# Altium schematic sheet mb1045.SchDoc
size A3; Revision: B.2(PCB.SCH)
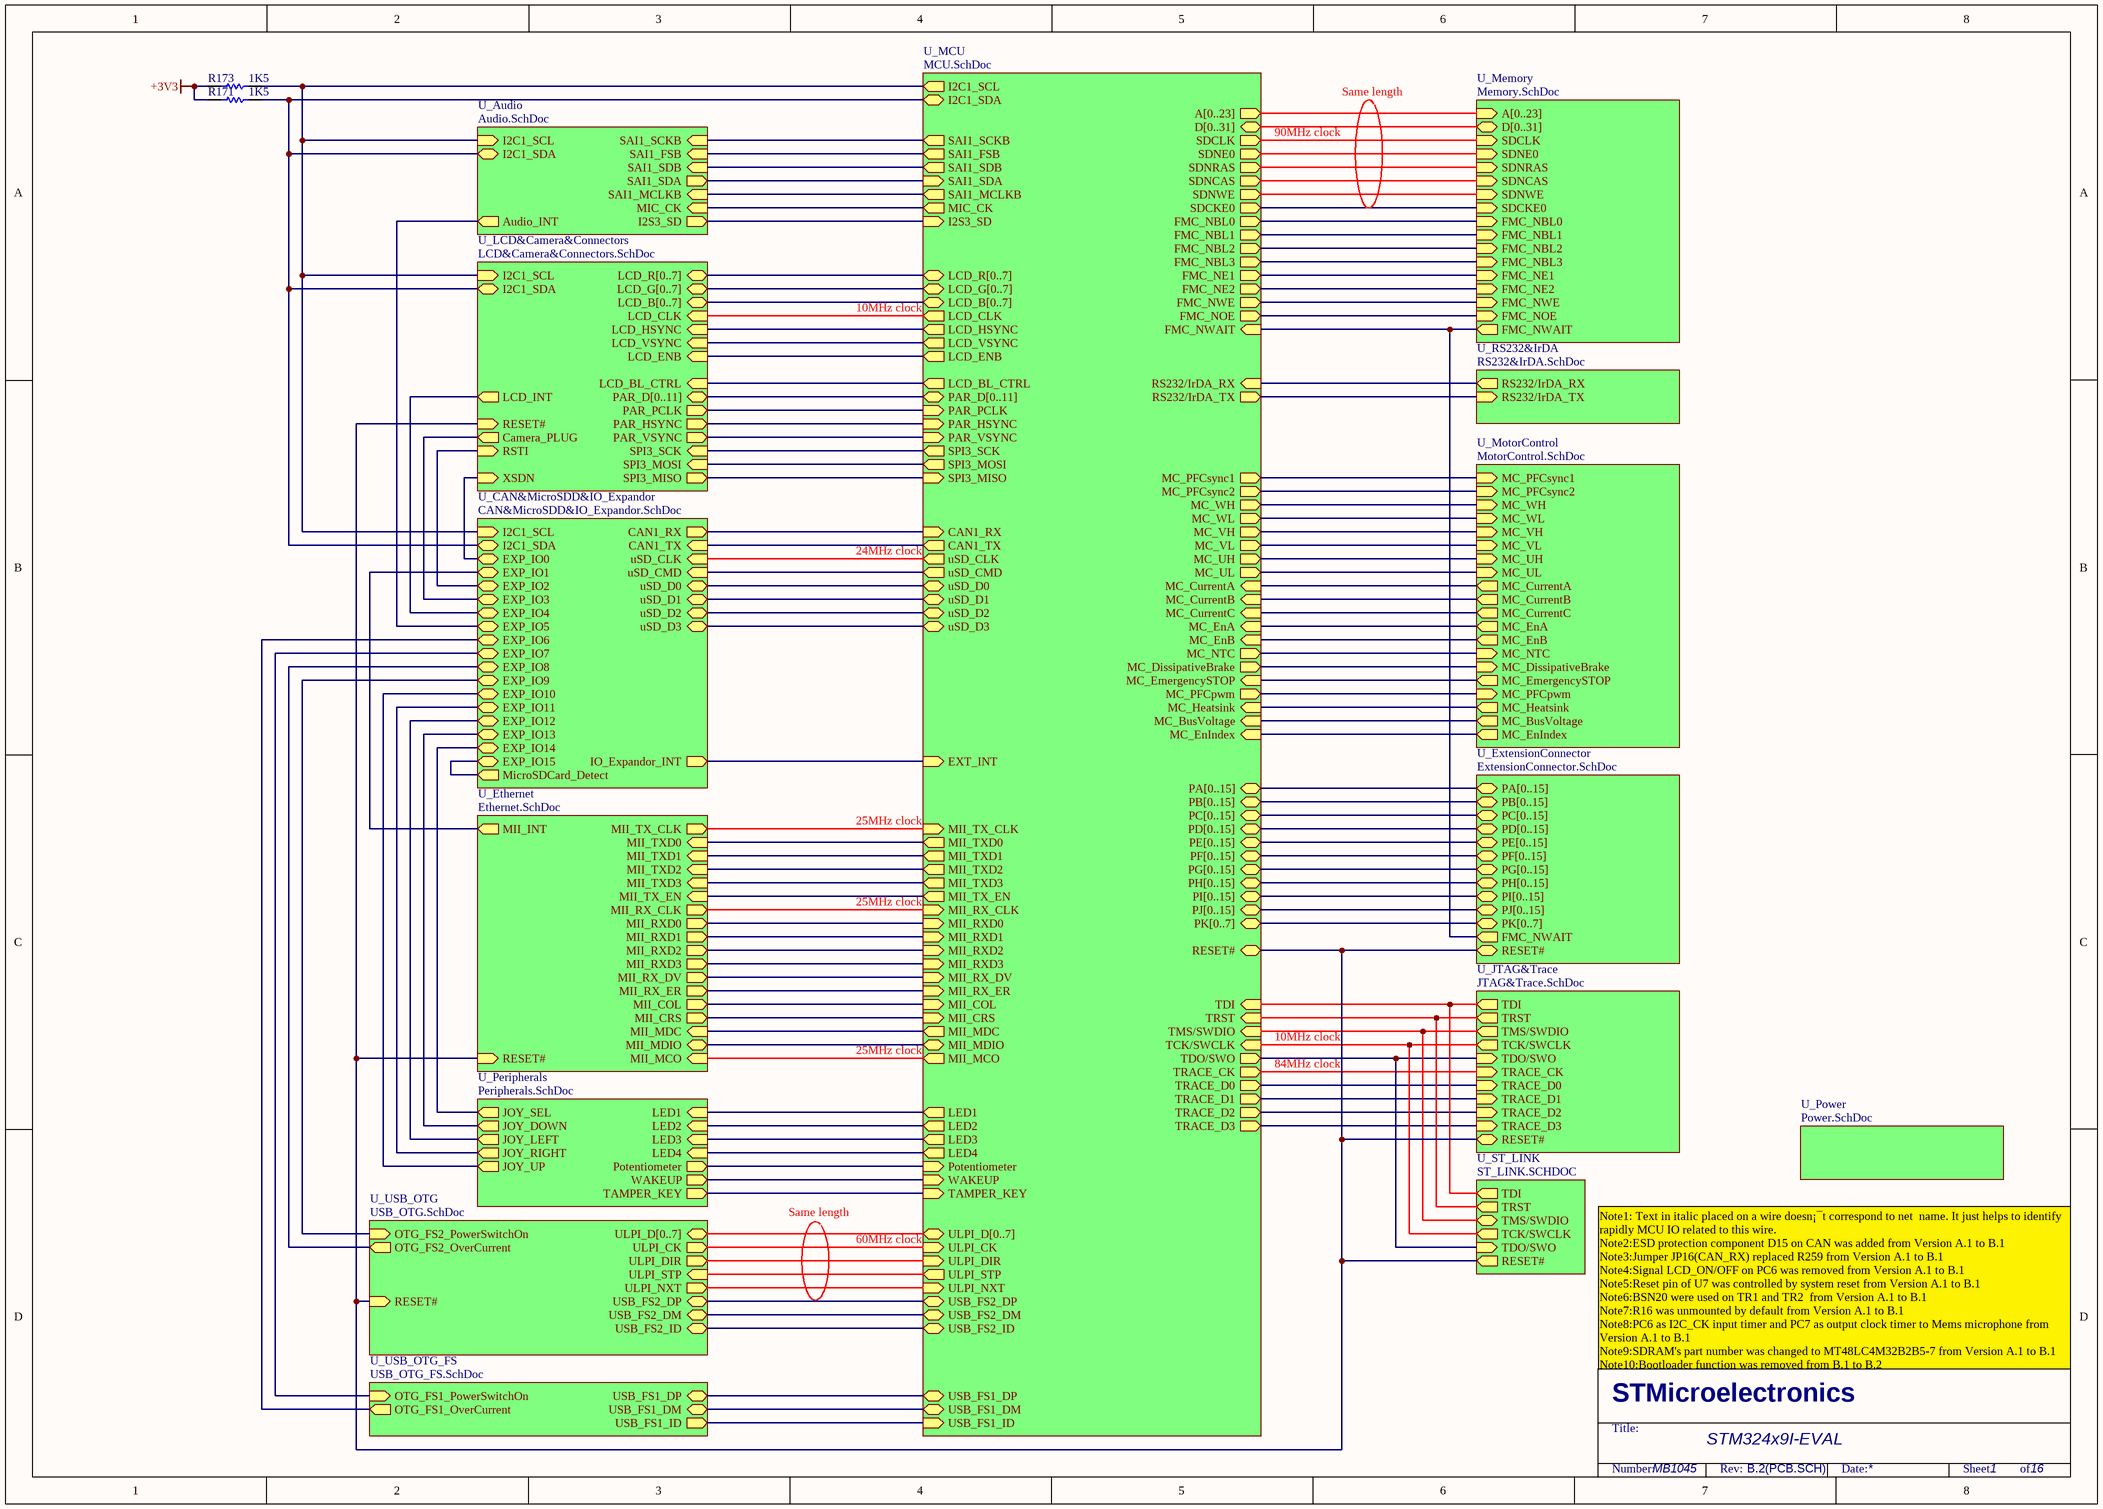
[diagram p0: mb1045.SchDoc]

## Parts
R171  1K5  [0603R]
R173  1K5  [0603R]

## Sub-sheets
U_Audio = Audio.SchDoc: SAI1_SCKB (in), SAI1_FSB (in), SAI1_SDB (in), SAI1_SDA (out), Audio_INT (out), I2C1_SDA (bidir), I2C1_SCL (in), SAI1_MCLKB (in), MIC_CK (in), I2S3_SD (out)
U_CAN&MicroSDD&IO_Expandor = CAN&MicroSDD&IO_Expandor.SchDoc: CAN1_TX (in), CAN1_RX (out), uSD_CLK (in), uSD_CMD (in), uSD_D0 (bidir), uSD_D1 (bidir), uSD_D2 (bidir), uSD_D3 (bidir), MicroSDCard_Detect (out), I2C1_SCL (in), I2C1_SDA (bidir), IO_Expandor_INT (out), EXP_IO2 (bidir), EXP_IO3 (bidir), EXP_IO4 (bidir), EXP_IO5 (bidir), EXP_IO6 (bidir), EXP_IO7 (bidir), EXP_IO8 (bidir), EXP_IO1 (bidir), EXP_IO9 (bidir), EXP_IO10 (bidir), EXP_IO11 (bidir), EXP_IO12 (bidir), EXP_IO13 (bidir), EXP_IO14 (bidir), EXP_IO15 (bidir), EXP_IO0 (bidir)
U_Ethernet = Ethernet.SchDoc: MII_TXD0 (in), MII_TX_EN (in), MII_TX_CLK (out), MII_RXD0 (out), MII_RX_ER (out), MII_RX_DV (out), MII_RX_CLK (out), MII_COL (out), MII_CRS (out), MII_MDC (in), MII_MDIO (bidir), RESET# (in), MII_TXD1 (in), MII_TXD2 (in), MII_TXD3 (in), MII_RXD1 (out), MII_RXD2 (out), MII_RXD3 (out), MII_INT (out), MII_MCO (in)
U_ExtensionConnector = ExtensionConnector.SchDoc: PA[0..15] (bidir), PB[0..15] (bidir), PC[0..15] (bidir), PD[0..15] (bidir), PE[0..15] (bidir), PF[0..15] (bidir), PG[0..15] (bidir), PH[0..15] (bidir), PI[0..15] (bidir), PJ[0..15] (bidir), PK[0..7] (bidir), RESET# (bidir), FMC_NWAIT (out)
U_JTAG&Trace = JTAG&Trace.SchDoc: TDI (out), RESET# (bidir), TRACE_D3 (in), TRACE_D2 (in), TRACE_D1 (in), TRACE_D0 (in), TRACE_CK (in), TRST (out), TMS/SWDIO (out), TCK/SWCLK (out), TDO/SWO (in)
U_LCD&Camera&Connectors = LCD&Camera&Connectors.SchDoc: LCD_R[0..7] (bidir), LCD_HSYNC (in), LCD_VSYNC (in), LCD_CLK (in), LCD_ENB (in), LCD_BL_CTRL (in), I2C1_SDA (bidir), I2C1_SCL (in), LCD_B[0..7] (bidir), LCD_G[0..7] (bidir), RSTI (in), XSDN (in), PAR_HSYNC (out), PAR_PCLK (out), PAR_VSYNC (out), PAR_D[0..11] (bidir), SPI3_SCK (in), SPI3_MISO (out), SPI3_MOSI (in), LCD_INT (out), Camera_PLUG (out), RESET# (in)
U_MCU = MCU.SchDoc: PA[0..15] (bidir), PB[0..15] (bidir), PC[0..15] (bidir), PD[0..15] (bidir), PE[0..15] (bidir), PF[0..15] (bidir), PG[0..15] (bidir), PH[0..15] (bidir), PI[0..15] (bidir), WAKEUP (in), MC_EnA (in), MII_RX_CLK (in), MC_EnB (in), MII_MDIO (bidir), MC_EnIndex (in), ULPI_CK (in), MC_EmergencySTOP (in), MII_RX_DV (in), MC_UL (out), LCD_BL_CTRL (out), MC_PFCsync1 (out), RS232/IrDA_TX (out), RS232/IrDA_RX (in), USB_FS1_ID (in), CAN1_RX (in), USB_FS1_DM (bidir), MC_PFCpwm (out), CAN1_TX (out), USB_FS1_DP (bidir), MC_PFCsync2 (out), TMS/SWDIO (in), TCK/SWCLK (in), TDI (in), MC_VL (out), MC_WL (out), TDO/SWO (out), MIC_CK (out), TRST (in), I2C1_SCL (out), MII_TXD3 (out), MC_DissipativeBrake (out), I2C1_SDA (bidir), USB_FS2_ID (bidir), USB_FS2_DM (bidir), USB_FS2_DP (bidir), ULPI_STP (out), MII_MDC (out), MC_CurrentA (in), MII_TXD2 (out), MC_CurrentB (in), MII_TX_CLK (in), MC_CurrentC (in), MII_RXD0 (in), MC_BusVoltage (in), MII_RXD1 (in), MC_Heatsink (in), MC_UH (out), MC_VH (out), uSD_D0 (bidir), MC_WH (out), uSD_D1 (bidir), uSD_D2 (bidir), SPI3_SCK (out), uSD_D3 (bidir), SPI3_MISO (in), uSD_CLK (out), SPI3_MOSI (out), TAMPER_KEY (in), MII_CRS (in), LCD_ENB (out), uSD_CMD (out), FMC_NOE (out), FMC_NWE (out), FMC_NWAIT (in), I2S3_SD (in), FMC_NE1 (out), FMC_NBL3 (out), FMC_NBL2 (out), EXT_INT (in), MII_RX_ER (in), ULPI_DIR (in), LCD_HSYNC (out), LCD_VSYNC (out), LCD_CLK (out), FMC_NBL0 (out), FMC_NBL1 (out), TRACE_CK (out), TRACE_D0 (out), TRACE_D2 (out), TRACE_D1 (out), SAI1_SDA (in), TRACE_D3 (out), SAI1_SDB (out), SAI1_SCKB (out), SAI1_FSB (out), SAI1_MCLKB (out), Potentiometer (in), SDNRAS (out), LED1 (out), LED2 (out), SDCLK (out), FMC_NE2 (out), LED4 (out), LED3 (out), MII_TX_EN (out), MC_NTC (out), MII_TXD0 (out), MII_TXD1 (out), SDNCAS (out), SDCKE0 (out), SDNE0 (out), MII_COL (in), ULPI_NXT (in), SDNWE (out), MII_RXD2 (in), MII_RXD3 (in), LCD_R[0..7] (bidir), LCD_G[0..7] (bidir), LCD_B[0..7] (bidir), D[0..31] (bidir), A[0..23] (out), ULPI_D[0..7] (bidir), RESET# (bidir), PJ[0..15] (bidir), PK[0..7] (bidir), PAR_HSYNC (in), PAR_PCLK (in), PAR_VSYNC (in), PAR_D[0..11] (bidir), MII_MCO (out)
U_Memory = Memory.SchDoc: FMC_NE2 (in), FMC_NE1 (in), FMC_NWE (in), FMC_NOE (in), FMC_NWAIT (out), FMC_NBL0 (in), FMC_NBL1 (in), D[0..31] (bidir), A[0..23] (in), SDNCAS (in), SDNWE (in), SDNRAS (in), SDNE0 (in), SDCKE0 (in), SDCLK (in), FMC_NBL3 (in), FMC_NBL2 (in)
U_MotorControl = MotorControl.SchDoc: MC_EmergencySTOP (out), MC_CurrentA (out), MC_CurrentB (out), MC_CurrentC (out), MC_PFCsync1 (in), MC_PFCsync2 (in), MC_WL (in), MC_VH (in), MC_VL (in), MC_UH (in), MC_UL (in), MC_WH (in), MC_NTC (in), MC_DissipativeBrake (in), MC_PFCpwm (in), MC_EnA (out), MC_EnB (out), MC_Heatsink (out), MC_BusVoltage (out), MC_EnIndex (out)
U_Peripherals = Peripherals.SchDoc: LED4 (in), LED3 (in), LED1 (in), LED2 (in), JOY_SEL (out), JOY_DOWN (out), JOY_LEFT (out), JOY_RIGHT (out), JOY_UP (out), Potentiometer (out), WAKEUP (out), TAMPER_KEY (out)
U_Power = Power.SchDoc: no entries
U_RS232&IrDA = RS232&IrDA.SchDoc: RS232/IrDA_TX (in), RS232/IrDA_RX (out)
U_ST_LINK = ST_LINK.SCHDOC: TDI (out), TRST (out), TMS/SWDIO (bidir), TCK/SWCLK (out), TDO/SWO (in), RESET# (out)
U_USB_OTG = USB_OTG.SchDoc: ULPI_D[0..7] (bidir), ULPI_CK (out), ULPI_DIR (out), ULPI_NXT (out), ULPI_STP (in), RESET# (in), USB_FS2_DM (bidir), USB_FS2_DP (bidir), OTG_FS2_PowerSwitchOn (in), OTG_FS2_OverCurrent (out), USB_FS2_ID (bidir)
U_USB_OTG_FS = USB_OTG_FS.SchDoc: OTG_FS1_PowerSwitchOn (in), OTG_FS1_OverCurrent (out), USB_FS1_DM (bidir), USB_FS1_DP (bidir), USB_FS1_ID (out)

## Nets
+3V3: R171.1 R173.1
NetR171_2: R171.2 ; sheet U_Audio/I2C1_SDA, sheet U_MCU/I2C1_SDA, sheet U_CAN&MicroSDD&IO_Expandor/I2C1_SDA, sheet U_LCD&Camera&Connectors/I2C1_SDA
NetR173_2: R173.2 ; sheet U_Audio/I2C1_SCL, sheet U_MCU/I2C1_SCL, sheet U_CAN&MicroSDD&IO_Expandor/I2C1_SCL, sheet U_LCD&Camera&Connectors/I2C1_SCL
(unnamed): sheet U_Audio/SAI1_SCKB, sheet U_MCU/SAI1_SCKB
(unnamed): sheet U_Audio/SAI1_FSB, sheet U_MCU/SAI1_FSB
(unnamed): sheet U_Audio/SAI1_SDB, sheet U_MCU/SAI1_SDB
(unnamed): sheet U_Audio/SAI1_SDA, sheet U_MCU/SAI1_SDA
(unnamed): sheet U_Audio/Audio_INT, sheet U_CAN&MicroSDD&IO_Expandor/EXP_IO5
(unnamed): sheet U_Audio/SAI1_MCLKB, sheet U_MCU/SAI1_MCLKB
(unnamed): sheet U_Audio/MIC_CK, sheet U_MCU/MIC_CK
(unnamed): sheet U_Audio/I2S3_SD, sheet U_MCU/I2S3_SD
(unnamed): sheet U_JTAG&Trace/TDI, sheet U_MCU/TDI, sheet U_ST_LINK/TDI
(unnamed): sheet U_JTAG&Trace/RESET#, sheet U_MCU/RESET#, sheet U_ST_LINK/RESET#, sheet U_USB_OTG/RESET#, sheet U_ExtensionConnector/RESET#, sheet U_LCD&Camera&Connectors/RESET#, sheet U_Ethernet/RESET#
(unnamed): sheet U_JTAG&Trace/TRACE_D3, sheet U_MCU/TRACE_D3
(unnamed): sheet U_JTAG&Trace/TRACE_D2, sheet U_MCU/TRACE_D2
(unnamed): sheet U_JTAG&Trace/TRACE_D1, sheet U_MCU/TRACE_D1
(unnamed): sheet U_JTAG&Trace/TRACE_D0, sheet U_MCU/TRACE_D0
(unnamed): sheet U_JTAG&Trace/TRACE_CK, sheet U_MCU/TRACE_CK
(unnamed): sheet U_JTAG&Trace/TRST, sheet U_MCU/TRST, sheet U_ST_LINK/TRST
(unnamed): sheet U_JTAG&Trace/TMS/SWDIO, sheet U_MCU/TMS/SWDIO, sheet U_ST_LINK/TMS/SWDIO
(unnamed): sheet U_JTAG&Trace/TCK/SWCLK, sheet U_MCU/TCK/SWCLK, sheet U_ST_LINK/TCK/SWCLK
(unnamed): sheet U_JTAG&Trace/TDO/SWO, sheet U_MCU/TDO/SWO, sheet U_ST_LINK/TDO/SWO
(unnamed): sheet U_MCU/WAKEUP, sheet U_Peripherals/WAKEUP
(unnamed): sheet U_MCU/MC_EnA, sheet U_MotorControl/MC_EnA
(unnamed): sheet U_MCU/MII_RX_CLK, sheet U_Ethernet/MII_RX_CLK
(unnamed): sheet U_MCU/MC_EnB, sheet U_MotorControl/MC_EnB
(unnamed): sheet U_MCU/MII_MDIO, sheet U_Ethernet/MII_MDIO
(unnamed): sheet U_MCU/MC_EnIndex, sheet U_MotorControl/MC_EnIndex
(unnamed): sheet U_MCU/ULPI_CK, sheet U_USB_OTG/ULPI_CK
(unnamed): sheet U_MCU/MC_EmergencySTOP, sheet U_MotorControl/MC_EmergencySTOP
(unnamed): sheet U_MCU/MII_RX_DV, sheet U_Ethernet/MII_RX_DV
(unnamed): sheet U_MCU/MC_UL, sheet U_MotorControl/MC_UL
(unnamed): sheet U_MCU/LCD_BL_CTRL, sheet U_LCD&Camera&Connectors/LCD_BL_CTRL
(unnamed): sheet U_MCU/MC_PFCsync1, sheet U_MotorControl/MC_PFCsync1
(unnamed): sheet U_MCU/RS232/IrDA_TX, sheet U_RS232&IrDA/RS232/IrDA_TX
(unnamed): sheet U_MCU/RS232/IrDA_RX, sheet U_RS232&IrDA/RS232/IrDA_RX
(unnamed): sheet U_MCU/USB_FS1_ID, sheet U_USB_OTG_FS/USB_FS1_ID
(unnamed): sheet U_MCU/CAN1_RX, sheet U_CAN&MicroSDD&IO_Expandor/CAN1_RX
(unnamed): sheet U_MCU/USB_FS1_DM, sheet U_USB_OTG_FS/USB_FS1_DM
(unnamed): sheet U_MCU/MC_PFCpwm, sheet U_MotorControl/MC_PFCpwm
(unnamed): sheet U_MCU/CAN1_TX, sheet U_CAN&MicroSDD&IO_Expandor/CAN1_TX
(unnamed): sheet U_MCU/USB_FS1_DP, sheet U_USB_OTG_FS/USB_FS1_DP
(unnamed): sheet U_MCU/MC_PFCsync2, sheet U_MotorControl/MC_PFCsync2
(unnamed): sheet U_MCU/MC_VL, sheet U_MotorControl/MC_VL
(unnamed): sheet U_MCU/MC_WL, sheet U_MotorControl/MC_WL
(unnamed): sheet U_MCU/MII_TXD3, sheet U_Ethernet/MII_TXD3
(unnamed): sheet U_MCU/MC_DissipativeBrake, sheet U_MotorControl/MC_DissipativeBrake
(unnamed): sheet U_MCU/USB_FS2_ID, sheet U_USB_OTG/USB_FS2_ID
(unnamed): sheet U_MCU/USB_FS2_DM, sheet U_USB_OTG/USB_FS2_DM
(unnamed): sheet U_MCU/USB_FS2_DP, sheet U_USB_OTG/USB_FS2_DP
(unnamed): sheet U_MCU/ULPI_STP, sheet U_USB_OTG/ULPI_STP
(unnamed): sheet U_MCU/MII_MDC, sheet U_Ethernet/MII_MDC
(unnamed): sheet U_MCU/MC_CurrentA, sheet U_MotorControl/MC_CurrentA
(unnamed): sheet U_MCU/MII_TXD2, sheet U_Ethernet/MII_TXD2
(unnamed): sheet U_MCU/MC_CurrentB, sheet U_MotorControl/MC_CurrentB
(unnamed): sheet U_MCU/MII_TX_CLK, sheet U_Ethernet/MII_TX_CLK
(unnamed): sheet U_MCU/MC_CurrentC, sheet U_MotorControl/MC_CurrentC
(unnamed): sheet U_MCU/MII_RXD0, sheet U_Ethernet/MII_RXD0
(unnamed): sheet U_MCU/MC_BusVoltage, sheet U_MotorControl/MC_BusVoltage
(unnamed): sheet U_MCU/MII_RXD1, sheet U_Ethernet/MII_RXD1
(unnamed): sheet U_MCU/MC_Heatsink, sheet U_MotorControl/MC_Heatsink
(unnamed): sheet U_MCU/MC_UH, sheet U_MotorControl/MC_UH
(unnamed): sheet U_MCU/MC_VH, sheet U_MotorControl/MC_VH
(unnamed): sheet U_MCU/uSD_D0, sheet U_CAN&MicroSDD&IO_Expandor/uSD_D0
(unnamed): sheet U_MCU/MC_WH, sheet U_MotorControl/MC_WH
(unnamed): sheet U_MCU/uSD_D1, sheet U_CAN&MicroSDD&IO_Expandor/uSD_D1
(unnamed): sheet U_MCU/uSD_D2, sheet U_CAN&MicroSDD&IO_Expandor/uSD_D2
(unnamed): sheet U_MCU/SPI3_SCK, sheet U_LCD&Camera&Connectors/SPI3_SCK
(unnamed): sheet U_MCU/uSD_D3, sheet U_CAN&MicroSDD&IO_Expandor/uSD_D3
(unnamed): sheet U_MCU/SPI3_MISO, sheet U_LCD&Camera&Connectors/SPI3_MISO
(unnamed): sheet U_MCU/uSD_CLK, sheet U_CAN&MicroSDD&IO_Expandor/uSD_CLK
(unnamed): sheet U_MCU/SPI3_MOSI, sheet U_LCD&Camera&Connectors/SPI3_MOSI
(unnamed): sheet U_MCU/TAMPER_KEY, sheet U_Peripherals/TAMPER_KEY
(unnamed): sheet U_MCU/MII_CRS, sheet U_Ethernet/MII_CRS
(unnamed): sheet U_MCU/LCD_ENB, sheet U_LCD&Camera&Connectors/LCD_ENB
(unnamed): sheet U_MCU/uSD_CMD, sheet U_CAN&MicroSDD&IO_Expandor/uSD_CMD
(unnamed): sheet U_MCU/FMC_NOE, sheet U_Memory/FMC_NOE
(unnamed): sheet U_MCU/FMC_NWE, sheet U_Memory/FMC_NWE
(unnamed): sheet U_MCU/FMC_NWAIT, sheet U_Memory/FMC_NWAIT, sheet U_ExtensionConnector/FMC_NWAIT
(unnamed): sheet U_MCU/FMC_NE1, sheet U_Memory/FMC_NE1
(unnamed): sheet U_MCU/FMC_NBL3, sheet U_Memory/FMC_NBL3
(unnamed): sheet U_MCU/FMC_NBL2, sheet U_Memory/FMC_NBL2
(unnamed): sheet U_MCU/EXT_INT, sheet U_CAN&MicroSDD&IO_Expandor/IO_Expandor_INT
(unnamed): sheet U_MCU/MII_RX_ER, sheet U_Ethernet/MII_RX_ER
(unnamed): sheet U_MCU/ULPI_DIR, sheet U_USB_OTG/ULPI_DIR
(unnamed): sheet U_MCU/LCD_HSYNC, sheet U_LCD&Camera&Connectors/LCD_HSYNC
(unnamed): sheet U_MCU/LCD_VSYNC, sheet U_LCD&Camera&Connectors/LCD_VSYNC
(unnamed): sheet U_MCU/LCD_CLK, sheet U_LCD&Camera&Connectors/LCD_CLK
(unnamed): sheet U_MCU/FMC_NBL0, sheet U_Memory/FMC_NBL0
(unnamed): sheet U_MCU/FMC_NBL1, sheet U_Memory/FMC_NBL1
(unnamed): sheet U_MCU/Potentiometer, sheet U_Peripherals/Potentiometer
(unnamed): sheet U_MCU/SDNRAS, sheet U_Memory/SDNRAS
(unnamed): sheet U_MCU/LED1, sheet U_Peripherals/LED1
(unnamed): sheet U_MCU/LED2, sheet U_Peripherals/LED2
(unnamed): sheet U_MCU/SDCLK, sheet U_Memory/SDCLK
(unnamed): sheet U_MCU/FMC_NE2, sheet U_Memory/FMC_NE2
(unnamed): sheet U_MCU/LED4, sheet U_Peripherals/LED4
(unnamed): sheet U_MCU/LED3, sheet U_Peripherals/LED3
(unnamed): sheet U_MCU/MII_TX_EN, sheet U_Ethernet/MII_TX_EN
(unnamed): sheet U_MCU/MC_NTC, sheet U_MotorControl/MC_NTC
(unnamed): sheet U_MCU/MII_TXD0, sheet U_Ethernet/MII_TXD0
(unnamed): sheet U_MCU/MII_TXD1, sheet U_Ethernet/MII_TXD1
(unnamed): sheet U_MCU/SDNCAS, sheet U_Memory/SDNCAS
(unnamed): sheet U_MCU/SDCKE0, sheet U_Memory/SDCKE0
(unnamed): sheet U_MCU/SDNE0, sheet U_Memory/SDNE0
(unnamed): sheet U_MCU/MII_COL, sheet U_Ethernet/MII_COL
(unnamed): sheet U_MCU/ULPI_NXT, sheet U_USB_OTG/ULPI_NXT
(unnamed): sheet U_MCU/SDNWE, sheet U_Memory/SDNWE
(unnamed): sheet U_MCU/MII_RXD2, sheet U_Ethernet/MII_RXD2
(unnamed): sheet U_MCU/MII_RXD3, sheet U_Ethernet/MII_RXD3
(unnamed): sheet U_MCU/PAR_HSYNC, sheet U_LCD&Camera&Connectors/PAR_HSYNC
(unnamed): sheet U_MCU/PAR_PCLK, sheet U_LCD&Camera&Connectors/PAR_PCLK
(unnamed): sheet U_MCU/PAR_VSYNC, sheet U_LCD&Camera&Connectors/PAR_VSYNC
(unnamed): sheet U_MCU/MII_MCO, sheet U_Ethernet/MII_MCO
(unnamed): sheet U_Peripherals/JOY_SEL, sheet U_CAN&MicroSDD&IO_Expandor/EXP_IO14
(unnamed): sheet U_Peripherals/JOY_DOWN, sheet U_CAN&MicroSDD&IO_Expandor/EXP_IO13
(unnamed): sheet U_Peripherals/JOY_LEFT, sheet U_CAN&MicroSDD&IO_Expandor/EXP_IO12
(unnamed): sheet U_Peripherals/JOY_RIGHT, sheet U_CAN&MicroSDD&IO_Expandor/EXP_IO11
(unnamed): sheet U_Peripherals/JOY_UP, sheet U_CAN&MicroSDD&IO_Expandor/EXP_IO10
(unnamed): sheet U_USB_OTG/OTG_FS2_PowerSwitchOn, sheet U_CAN&MicroSDD&IO_Expandor/EXP_IO9
(unnamed): sheet U_USB_OTG/OTG_FS2_OverCurrent, sheet U_CAN&MicroSDD&IO_Expandor/EXP_IO8
(unnamed): sheet U_USB_OTG_FS/OTG_FS1_PowerSwitchOn, sheet U_CAN&MicroSDD&IO_Expandor/EXP_IO7
(unnamed): sheet U_USB_OTG_FS/OTG_FS1_OverCurrent, sheet U_CAN&MicroSDD&IO_Expandor/EXP_IO6
(unnamed): sheet U_CAN&MicroSDD&IO_Expandor/MicroSDCard_Detect, sheet U_CAN&MicroSDD&IO_Expandor/EXP_IO15
(unnamed): sheet U_CAN&MicroSDD&IO_Expandor/EXP_IO2, sheet U_LCD&Camera&Connectors/RSTI
(unnamed): sheet U_CAN&MicroSDD&IO_Expandor/EXP_IO3, sheet U_LCD&Camera&Connectors/Camera_PLUG
(unnamed): sheet U_CAN&MicroSDD&IO_Expandor/EXP_IO4, sheet U_LCD&Camera&Connectors/LCD_INT
(unnamed): sheet U_CAN&MicroSDD&IO_Expandor/EXP_IO1, sheet U_Ethernet/MII_INT
(unnamed): sheet U_CAN&MicroSDD&IO_Expandor/EXP_IO0, sheet U_LCD&Camera&Connectors/XSDN

## Buses and harness runs
bus sheet U_ExtensionConnector/PA[0..15] = sheet U_MCU/PA[0..15]
bus sheet U_ExtensionConnector/PB[0..15] = sheet U_MCU/PB[0..15]
bus sheet U_ExtensionConnector/PC[0..15] = sheet U_MCU/PC[0..15]
bus sheet U_ExtensionConnector/PD[0..15] = sheet U_MCU/PD[0..15]
bus sheet U_ExtensionConnector/PE[0..15] = sheet U_MCU/PE[0..15]
bus sheet U_ExtensionConnector/PF[0..15] = sheet U_MCU/PF[0..15]
bus sheet U_ExtensionConnector/PG[0..15] = sheet U_MCU/PG[0..15]
bus sheet U_ExtensionConnector/PH[0..15] = sheet U_MCU/PH[0..15]
bus sheet U_ExtensionConnector/PI[0..15] = sheet U_MCU/PI[0..15]
bus sheet U_ExtensionConnector/PJ[0..15] = sheet U_MCU/PJ[0..15]
bus sheet U_ExtensionConnector/PK[0..7] = sheet U_MCU/PK[0..7]
bus sheet U_LCD&Camera&Connectors/LCD_B[0..7] = sheet U_MCU/LCD_B[0..7]
bus sheet U_LCD&Camera&Connectors/LCD_G[0..7] = sheet U_MCU/LCD_G[0..7]
bus sheet U_LCD&Camera&Connectors/LCD_R[0..7] = sheet U_MCU/LCD_R[0..7]
bus sheet U_LCD&Camera&Connectors/PAR_D[0..11] = sheet U_MCU/PAR_D[0..11]
bus sheet U_MCU/A[0..23] = sheet U_Memory/A[0..23]
bus sheet U_MCU/D[0..31] = sheet U_Memory/D[0..31]
bus sheet U_MCU/ULPI_D[0..7] = sheet U_USB_OTG/ULPI_D[0..7]

## Notes on the sheet
- Same length
- 90MHz clock
- 10MHz clock
- 24MHz clock
- 25MHz clock
- 84MHz clock
- 60MHz clock
- Note1: Text in italic placed on a wire doesn¡¯t correspond to net  name. It just helps to identify rapidly MCU IO related to this wire.
  Note2:ESD protection component D15 on CAN was added from Version A.1 to B.1
  Note3:Jumper JP16(CAN_RX) replaced R259 from Version A.1 to B.1
  Note4:Signal LCD_ON/OFF on PC6 was removed from Version A.1 to B.1
  Note5:Reset pin of U7 was controlled by system reset from Version A.1 to B.1
  Note6:BSN20 were used on TR1 and TR2  from Version A.1 to B.1
  Note7:R16 was unmounted by default from Version A.1 to B.1
  Note8:PC6 as I2C_CK input timer and PC7 as output clock timer to Mems microphone from Version A.1 to B.1
  Note9:SDRAM's part number was changed to MT48LC4M32B2B5-7 from Version A.1 to B.1
  Note10:Bootloader function was removed from B.1 to B.2
- STM324x9I-EVAL
- MB1045
- 1
- 16
- STMicroelectronics
- Title:
- Number:
- Rev:
- Date:
- Sheet          of

## Library data of the parts
R171 R173 = Res1: Resistor; Value: 1K; Published: 8-Jun-2000; Revision: July-2002: Re-released for DXP Platform.; Publisher: Altium Limited